# Altium project Longboard_32bit_ext.PrjPCB (part 6 of 6)
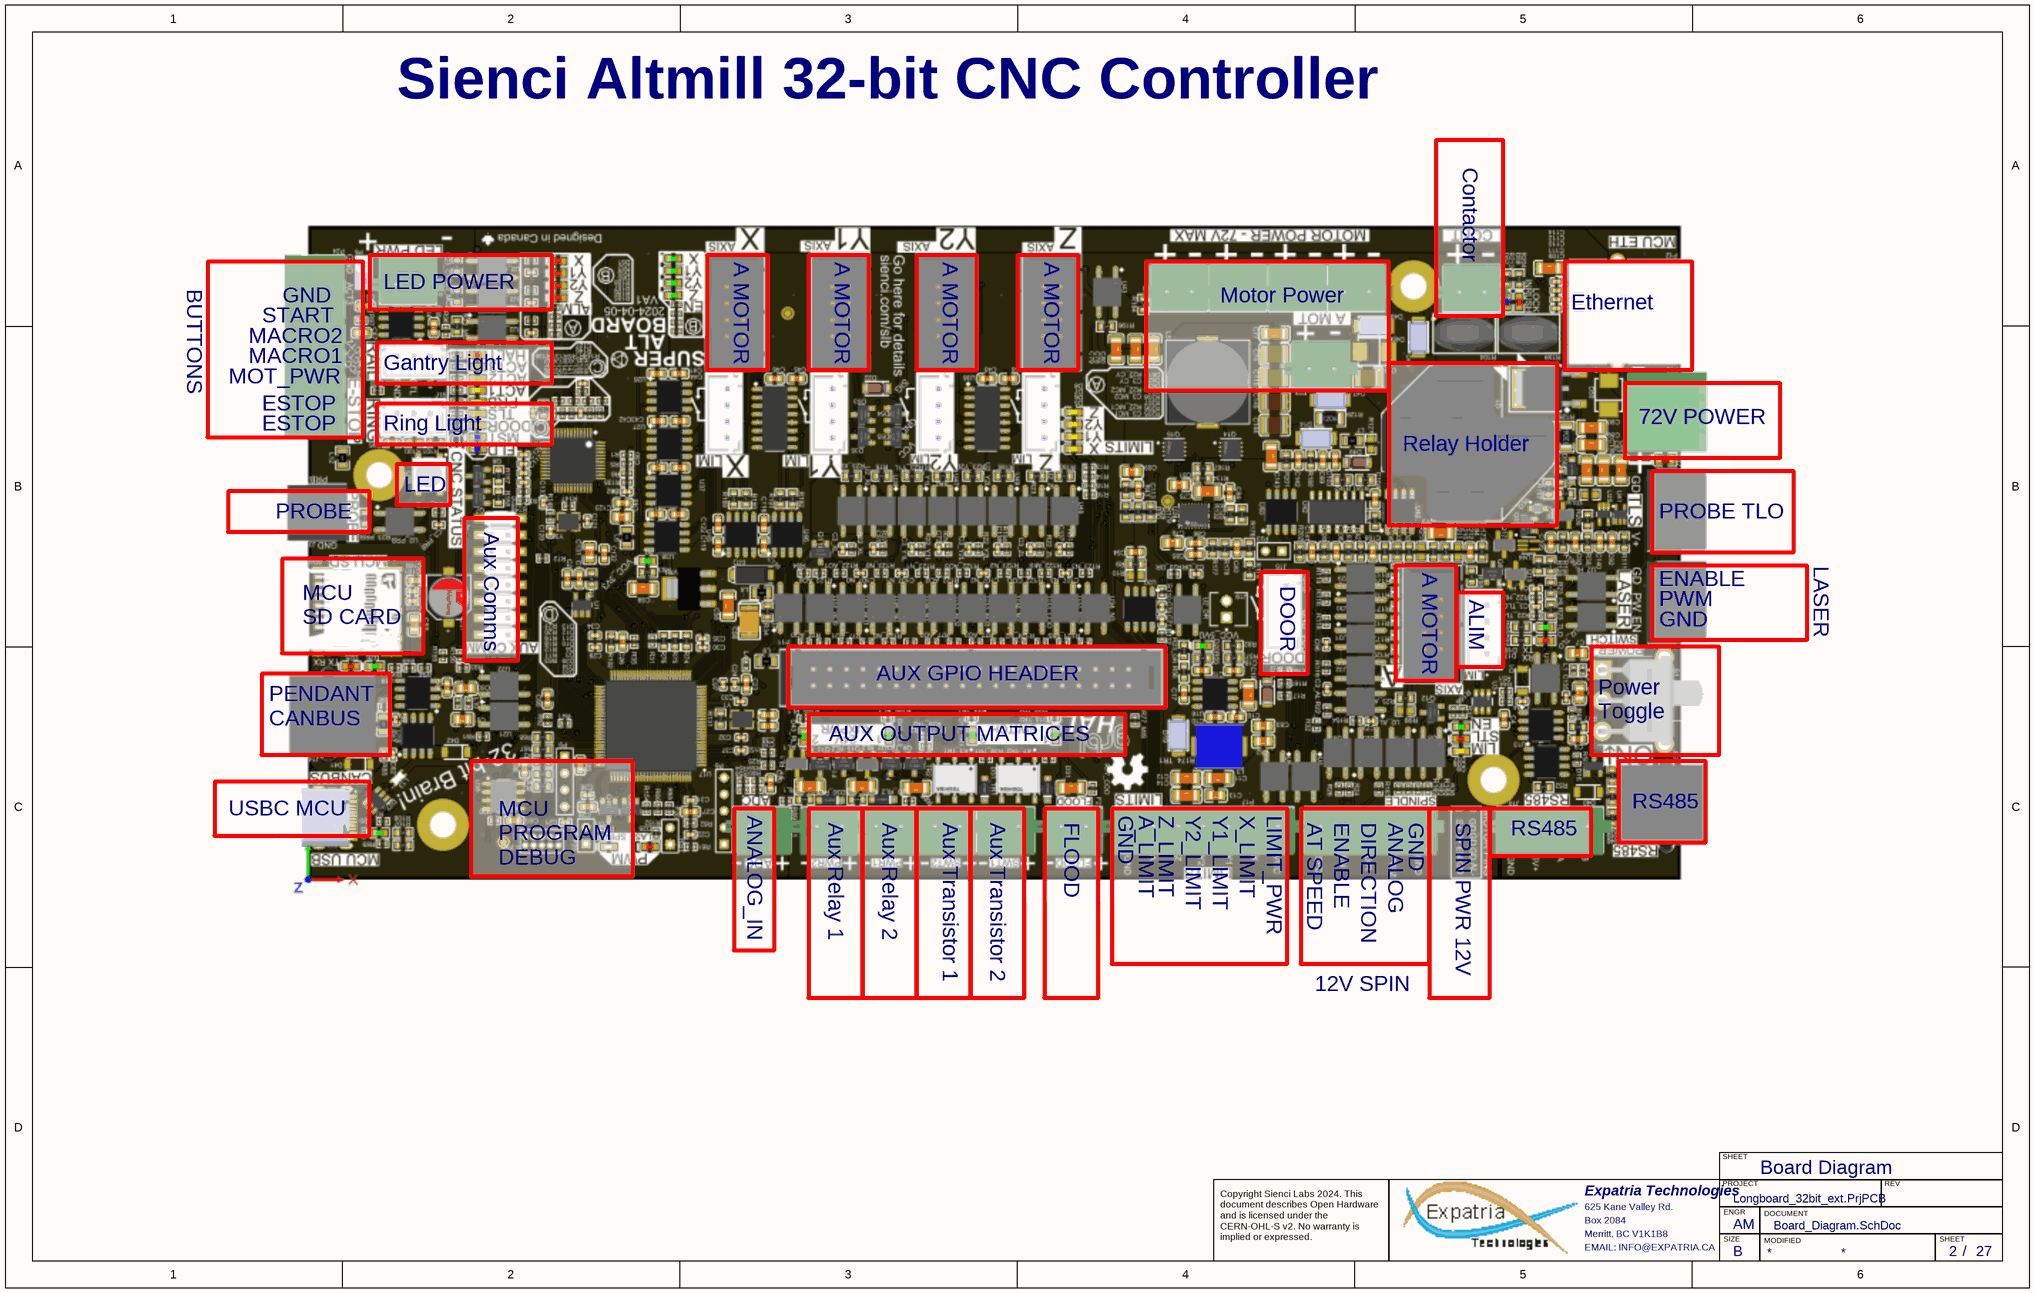
[diagram p28: Board_Diagram.SchDoc]

## Nets that join several sheets
GND: Limit_Switches (9 pins), Spindle_Control (10 pins), RS485 (C7.1 L2.1), DC_Power_Regulation (12 pins), 5V_Power_Supply (14 pins), 24V_Power_Supply (24 pins), DC_Power_Switching (37 pins), Stepper_driver_group (35 pins), Aux_Outputs (15 pins), Sienci CNC Controller/Additional IO/RL1 (Q2_RL1.2 Q10_RL1.2 R89_RL1.1), Sienci CNC Controller/Additional IO/RL2 (Q2_RL2.2 Q10_RL2.2 R89_RL2.1), Neopixel_Driver (8 pins), Sienci CNC Controller/Additional IO/TR1 (K1_TR1.2 Q9_TR1.2 R174_TR1.1), External_Stepper (7 pins), Sienci CNC Controller/Additional IO/AO0 (R77_AO0.1), Sienci CNC Controller/Additional IO/AO1 (R77_AO1.1), Sienci CNC Controller/Additional IO/AO2 (R77_AO2.1), Sienci CNC Controller/Additional IO/AO3 (R77_AO3.1), Sienci CNC Controller/Additional IO/COO (R77_COO.1), Sienci CNC Controller/Additional IO/MIS (R77_MIS.1), Sienci CNC Controller/Additional IO/N0 (U34_N0.2), Sienci CNC Controller/Additional IO/N1 (U34_N1.2), Sienci CNC Controller/Additional IO/N2 (U34_N2.2), Sienci CNC Controller/Additional IO/N3 (U34_N3.2), Sienci CNC Controller/Additional IO/TR2 (K1_TR2.2 Q9_TR2.2 R174_TR2.1)
INPUT_VCC: DC_Power_Regulation (C89.2 C90.2 L7.1 P10.1), DC_Power_Switching (8 pins)
LIMIT_VCC_SEL: Limit_Switches (10 pins), Sienci CNC Controller/Limit and Homing Inputs/TLO (R23_TLO.1), Sienci CNC Controller/Limit and Homing Inputs/PRB (R23_PRB.1), Sienci CNC Controller/Limit and Homing Inputs/XL (R23_XL.1), Sienci CNC Controller/Limit and Homing Inputs/Y1L (R23_Y1L.1), Sienci CNC Controller/Limit and Homing Inputs/Y2L (R23_Y2L.1), Sienci CNC Controller/Limit and Homing Inputs/ZL (R23_ZL.1), Sienci CNC Controller/Limit and Homing Inputs/AL (R23_AL.1), Sienci CNC Controller/Limit and Homing Inputs/DR (R23_DR.1)
MCU_GND: Longboard_32bit (C1.1 C2.1 U1.3), MCU_STM32F412VGT6 (48 pins), I2C_Keypad (P8.5 P9.4), Sienci CNC Controller/Limit and Homing Inputs/TLO (C3_TLO.1 U2_TLO.3), Sienci CNC Controller/Limit and Homing Inputs/PRB (C3_PRB.1 U2_PRB.3), Sienci CNC Controller/Limit and Homing Inputs/XL (C3_XL.1 U2_XL.3), Sienci CNC Controller/Limit and Homing Inputs/Y1L (C3_Y1L.1 U2_Y1L.3), Sienci CNC Controller/Limit and Homing Inputs/Y2L (C3_Y2L.1 U2_Y2L.3), Sienci CNC Controller/Limit and Homing Inputs/ZL (C3_ZL.1 U2_ZL.3), Sienci CNC Controller/Limit and Homing Inputs/AL (C3_AL.1 U2_AL.3), Sienci CNC Controller/Limit and Homing Inputs/DR (C3_DR.1 U2_DR.3), Sienci CNC Controller/User Inputs/CY (C3_CY.1 U2_CY.3), Sienci CNC Controller/User Inputs/MC1 (C3_MC1.1 U2_MC1.3), Sienci CNC Controller/User Inputs/HL (C3_HL.1 U2_HL.3), Sienci CNC Controller/User Inputs/MC2 (C3_MC2.1 U2_MC2.3), Spindle_Control (14 pins), RS485 (C134.2 D1.1 U12.4 U15.2), Ethernet_Interface (33 pins), DC_Power_Regulation (9 pins), Stepper_driver_group (20 pins), Aux_Outputs (9 pins), Neopixel_Driver (C68.2 U14.4), External_Stepper (6 pins), Sienci CNC Controller/Additional IO/AO0 (U33_AO0.2), Sienci CNC Controller/Additional IO/AO1 (U33_AO1.2), Sienci CNC Controller/Additional IO/AO2 (U33_AO2.2), Sienci CNC Controller/Additional IO/AO3 (U33_AO3.2), Sienci CNC Controller/Additional IO/COO (U33_COO.2), Sienci CNC Controller/Additional IO/MIS (U33_MIS.2), Sienci CNC Controller/Additional IO/N0 (C107_N0.1 U34_N0.3), Sienci CNC Controller/Additional IO/N1 (C107_N1.1 U34_N1.3), Sienci CNC Controller/Additional IO/N2 (C107_N2.1 U34_N2.3), Sienci CNC Controller/Additional IO/N3 (C107_N3.1 U34_N3.3), CANBUS_Pendant (9 pins), USB_Connector (9 pins)
MOTOR_VCC_80V: DC_Power_Regulation (R184.2), DC_Power_Switching (C91.2 D46.2 D48.2 K2.87), Stepper_driver_group (5 pins)
VCC_MCU_3V3: Longboard_32bit (C2.2 R8.2 U1.5), MCU_STM32F412VGT6 (32 pins), I2C_Keypad (P9.1), Limit_Switches (8 pins), Sienci CNC Controller/Limit and Homing Inputs/TLO (R22_TLO.2), Sienci CNC Controller/Limit and Homing Inputs/PRB (R22_PRB.2), Sienci CNC Controller/Limit and Homing Inputs/XL (R22_XL.2), Sienci CNC Controller/Limit and Homing Inputs/Y1L (R22_Y1L.2), Sienci CNC Controller/Limit and Homing Inputs/Y2L (R22_Y2L.2), Sienci CNC Controller/Limit and Homing Inputs/ZL (R22_ZL.2), Sienci CNC Controller/Limit and Homing Inputs/AL (R22_AL.2), Sienci CNC Controller/Limit and Homing Inputs/DR (R22_DR.2), Misc_switches (D10.A D11.A D12.A D13.A), Sienci CNC Controller/User Inputs/CY (R22_CY.2), Sienci CNC Controller/User Inputs/MC1 (R22_MC1.2), Sienci CNC Controller/User Inputs/HL (R22_HL.2), Sienci CNC Controller/User Inputs/MC2 (R22_MC2.2), Spindle_Control (R32.1 R35.1 R164.1), RS485 (D1.2 D17.A D18.A R44.2), Ethernet_Interface (8 pins), DC_Power_Regulation (C59.2 D24.A VR1.2), Stepper_driver_group (24 pins), Aux_Outputs (R110.1), Neopixel_Driver (R96.2), External_Stepper (D37.A D38.A R119.2), Sienci CNC Controller/Additional IO/N0 (R123_N0.1), Sienci CNC Controller/Additional IO/N1 (R123_N1.1), Sienci CNC Controller/Additional IO/N2 (R123_N2.1), Sienci CNC Controller/Additional IO/N3 (R123_N3.1), CANBUS_Pendant (6 pins)
VCC_MCU_5V0: I2C_Keypad (P8.1), Spindle_Control (R151.2 R152.2), DC_Power_Regulation (7 pins), Aux_Outputs (R155.2 R156.2), CANBUS_Pendant (C60.2 L10.1)
VCC_SYS_5V0: Limit_Switches (R9.1), Sienci CNC Controller/User Inputs/CY (R23_CY.1), Sienci CNC Controller/User Inputs/MC1 (R23_MC1.1), Sienci CNC Controller/User Inputs/HL (R23_HL.1), Sienci CNC Controller/User Inputs/MC2 (R23_MC2.1), Spindle_Control (6 pins), RS485 (C7.2 L1.1), DC_Power_Regulation (8 pins), 5V_Power_Supply (8 pins), DC_Power_Switching (18 pins), Stepper_driver_group (32 pins), Aux_Outputs (P11.7 P11.15 R112.1), Sienci CNC Controller/Additional IO/RL1 (R105_RL1.2), Sienci CNC Controller/Additional IO/RL2 (R105_RL2.2), Neopixel_Driver (C95.2 R97.2 R101.2 U28.1), Sienci CNC Controller/Additional IO/TR1 (R33_TR1.2), External_Stepper (R113.1 R115.1 R117.1 R120.2), Sienci CNC Controller/Additional IO/AO0 (R121_AO0.1), Sienci CNC Controller/Additional IO/AO1 (R121_AO1.1), Sienci CNC Controller/Additional IO/AO2 (R121_AO2.1), Sienci CNC Controller/Additional IO/AO3 (R121_AO3.1), Sienci CNC Controller/Additional IO/COO (R121_COO.1), Sienci CNC Controller/Additional IO/MIS (R121_MIS.1), Sienci CNC Controller/Additional IO/TR2 (R33_TR2.2)
VCC_SYS_24V0: Limit_Switches (R10.1), DC_Power_Regulation (R196.2), 5V_Power_Supply (C15.2 C16.2 U16.2), 24V_Power_Supply (7 pins), DC_Power_Switching (D45.2 K2.85 P6.2), Aux_Outputs (P11.18), Sienci CNC Controller/Additional IO/RL1 (D30_RL1.2 P18_RL1.2 R109_RL1.2), Sienci CNC Controller/Additional IO/RL2 (D30_RL2.2 P18_RL2.2 R109_RL2.2), Neopixel_Driver (P5.1 R100.2)
A_LIM: MCU_STM32F412VGT6 (U17.45), Limit_Switches (R17.2), Sienci CNC Controller/Limit and Homing Inputs/AL (C3_AL.2 R22_AL.1 U2_AL.4)
A_LIM_ext: Limit_Switches (J8.4 P17.2), Sienci CNC Controller/Limit and Homing Inputs/AL (U2_AL.2)
AL_A: Longboard_32bit (TP28.1), MCU_STM32F412VGT6 (U17.83), External_Stepper (C96.2 R119.1 R161.1 U32.4)
ANALOG_IN: Longboard_32bit (TP60.1), MCU_STM32F412VGT6 (U17.23), Aux_Outputs (R59.1)
AUX_IN0_5V: Aux_Outputs (P11.22), Sienci CNC Controller/Additional IO/N0 (R124_N0.1)
AUX_IN1_5V: Aux_Outputs (P11.26), Sienci CNC Controller/Additional IO/N1 (R124_N1.1)
AUX_IN2_5V: Aux_Outputs (P11.30), Sienci CNC Controller/Additional IO/N2 (R124_N2.1)
AUX_IN3_5V: Aux_Outputs (P11.34), Sienci CNC Controller/Additional IO/N3 (R124_N3.1)
AUX_IN_0: Longboard_32bit (TP53.1), MCU_STM32F412VGT6 (U17.59), Sienci CNC Controller/Additional IO/N0 (C107_N0.2 R123_N0.2 U34_N0.4)
AUX_IN_1: Longboard_32bit (TP54.1), MCU_STM32F412VGT6 (U17.60), Sienci CNC Controller/Additional IO/N1 (C107_N1.2 R123_N1.2 U34_N1.4)
AUX_IN_2: Longboard_32bit (TP55.1), MCU_STM32F412VGT6 (U17.61), Sienci CNC Controller/Additional IO/N2 (C107_N2.2 R123_N2.2 U34_N2.4)
AUX_IN_3: Longboard_32bit (TP56.1), MCU_STM32F412VGT6 (U17.62), Sienci CNC Controller/Additional IO/N3 (C107_N3.2 R123_N3.2 U34_N3.4)
AUX_OUT_0_5V: Aux_Outputs (P11.19), Sienci CNC Controller/Additional IO/RL1 (Q2_RL1.1 Q10_RL1.1 R89_RL1.2), Sienci CNC Controller/Additional IO/AO0 (R77_AO0.2 U33_AO0.3)
AUX_OUT_1_5V: Aux_Outputs (P11.21), Sienci CNC Controller/Additional IO/RL2 (Q2_RL2.1 Q10_RL2.1 R89_RL2.2), Sienci CNC Controller/Additional IO/AO1 (R77_AO1.2 U33_AO1.3)
AUX_OUT_2_5V: Aux_Outputs (P11.25), Sienci CNC Controller/Additional IO/TR1 (Q9_TR1.1 R39_TR1.1 R174_TR1.2), Sienci CNC Controller/Additional IO/AO2 (R77_AO2.2 U33_AO2.3)
AUX_OUT_3_5V: Aux_Outputs (P11.27), Sienci CNC Controller/Additional IO/AO3 (R77_AO3.2 U33_AO3.3), Sienci CNC Controller/Additional IO/TR2 (Q9_TR2.1 R39_TR2.1 R174_TR2.2)
AUXOUT_0: Longboard_32bit (TP1.1), MCU_STM32F412VGT6 (U17.8), Sienci CNC Controller/Additional IO/AO0 (R122_AO0.1)
AUXOUT_1: Longboard_32bit (TP2.1), MCU_STM32F412VGT6 (U17.15), Sienci CNC Controller/Additional IO/AO1 (R122_AO1.1)
AUXOUT_2: Longboard_32bit (TP33.1), MCU_STM32F412VGT6 (U17.16), Sienci CNC Controller/Additional IO/AO2 (R122_AO2.1)
AUXOUT_3: Longboard_32bit (TP34.1), MCU_STM32F412VGT6 (U17.65), Sienci CNC Controller/Additional IO/AO3 (R122_AO3.1)
CAN_RX: Longboard_32bit (TP32.1), MCU_STM32F412VGT6 (U17.81), CANBUS_Pendant (R94.1 U18.2)
CAN_TX: Longboard_32bit (TP31.1), MCU_STM32F412VGT6 (U17.82), CANBUS_Pendant (R95.1 U18.3)
COOLANT: MCU_STM32F412VGT6 (U17.53), Aux_Outputs (Q6.1 R157.2), Sienci CNC Controller/Additional IO/COO (R122_COO.1)
COOLANT_5V: Aux_Outputs (J17.2 P11.31), Sienci CNC Controller/Additional IO/COO (R77_COO.2 U33_COO.3)
CYC/ST: MCU_STM32F412VGT6 (U17.79), Misc_switches (R20.2), Sienci CNC Controller/User Inputs/CY (C3_CY.2 R22_CY.1 U2_CY.4)
DIR: MCU_STM32F412VGT6 (U17.35), RS485 (R51.2)
DIR_A: Longboard_32bit (TP52.1), MCU_STM32F412VGT6 (U17.42), External_Stepper (R116.1)
DIR_A_EXT: Aux_Outputs (P11.6), External_Stepper (P20.3 R171.1 U30.3)
DIR_X: Longboard_32bit (TP48.1), MCU_STM32F412VGT6 (U17.38), Stepper_driver_group (U26.3)
DIR_Y1: Longboard_32bit (TP49.1), MCU_STM32F412VGT6 (U17.39), Stepper_driver_group (U27.3)
DIR_Y2: Longboard_32bit (TP51.1), MCU_STM32F412VGT6 (U17.41), Stepper_driver_group (U37.3)
DIR_Z: Longboard_32bit (TP50.1), MCU_STM32F412VGT6 (U17.40), Stepper_driver_group (U38.3)
DOOR: Longboard_32bit (TP58.1), MCU_STM32F412VGT6 (U17.88), Limit_Switches (R63.2), Sienci CNC Controller/Limit and Homing Inputs/DR (C3_DR.2 R22_DR.1 U2_DR.4)
DOOR_IN_5V: Limit_Switches (J15.4), Sienci CNC Controller/Limit and Homing Inputs/DR (U2_DR.2), Aux_Outputs (P11.13)
EN_A_EXT: Aux_Outputs (P11.8), External_Stepper (P20.5 R172.1 U31.3)
ENN_X: Longboard_32bit (TP35.1), MCU_STM32F412VGT6 (U17.85), Stepper_driver_group (R185.1 U45.2)
ENN_Y1: Longboard_32bit (TP39.1 TP41.1), MCU_STM32F412VGT6 (U17.64), Stepper_driver_group (R186.1 R187.1 U45.3 U46.2)
ENN_Z: Longboard_32bit (TP40.1), MCU_STM32F412VGT6 (U17.84), Stepper_driver_group (R188.1 U46.3)
ESTOP_5V_EN: DC_Power_Regulation (P23.1 P24.6), DC_Power_Switching (6 pins)
HALT: Longboard_32bit (TP20.1 U1.2), Misc_switches (R21.2), Sienci CNC Controller/User Inputs/HL (C3_HL.2 R22_HL.1 U2_HL.4)
HALT_ext: Sienci CNC Controller/User Inputs/HL (U2_HL.2), DC_Power_Regulation (D32.K Q3.3 R38.1)
HALT_n: Longboard_32bit (C1.2 R8.1 TP19.1 U1.4), MCU_STM32F412VGT6 (U17.51), I2C_Keypad (P8.3)
HALT_PENDANT: Longboard_32bit (TP18.1 U1.1), CANBUS_Pendant (C65.2 R90.1 U21.4)
KPSTR: MCU_STM32F412VGT6 (R64.1 U17.89), I2C_Keypad (P8.4), CANBUS_Pendant (C66.2 R92.1 U22.4)
LASER_EN: Longboard_32bit (TP57.1), MCU_STM32F412VGT6 (U17.80), Spindle_Control (Q12.1 R37.1 R166.2)
Laser_PWM: Longboard_32bit (TP59.1), MCU_STM32F412VGT6 (U17.63), Spindle_Control (Q5.1 R41.1 R154.2)
LED Control: Longboard_32bit (TP36.1), MCU_STM32F412VGT6 (U17.66), Neopixel_Driver (U14.2)
MAC1: Longboard_32bit (TP16.1), MCU_STM32F412VGT6 (U17.98), Misc_switches (R18.2), Sienci CNC Controller/User Inputs/MC1 (C3_MC1.2 R22_MC1.1 U2_MC1.4)
MAC2: Longboard_32bit (TP17.1), MCU_STM32F412VGT6 (U17.97), Misc_switches (R19.2), Sienci CNC Controller/User Inputs/MC2 (C3_MC2.2 R22_MC2.1 U2_MC2.4)
Macro1_ext: Sienci CNC Controller/User Inputs/MC1 (U2_MC1.2), DC_Power_Regulation (P24.4)
Macro2_ext: Sienci CNC Controller/User Inputs/MC2 (U2_MC2.2), DC_Power_Regulation (P24.3)
MIST: MCU_STM32F412VGT6 (U17.90), Aux_Outputs (Q7.1 R158.2), Sienci CNC Controller/Additional IO/MIS (R122_MIS.1)
MIST_5V: Aux_Outputs (P11.33), Sienci CNC Controller/Additional IO/MIS (R77_MIS.2 U33_MIS.3)
MOTOR_nPGD: DC_Power_Regulation (Q3.1), DC_Power_Switching (U44.4)
PRB_TLO: MCU_STM32F412VGT6 (U17.9), Limit_Switches (R11.2), Sienci CNC Controller/Limit and Homing Inputs/TLO (C3_TLO.2 R22_TLO.1 U2_TLO.4)
PRB_TLO_ext: Limit_Switches (J2.2), Sienci CNC Controller/Limit and Homing Inputs/TLO (U2_TLO.2)
PROBE: MCU_STM32F412VGT6 (U17.33), Limit_Switches (R12.2), Sienci CNC Controller/Limit and Homing Inputs/PRB (C3_PRB.2 R22_PRB.1 U2_PRB.4)
PROBE_ext: Limit_Switches (J3.2), Sienci CNC Controller/Limit and Homing Inputs/PRB (U2_PRB.2)
PRU_RESET: Longboard_32bit (TP21.1), MCU_STM32F412VGT6 (U17.57), Ethernet_Interface (J1.14)
PWR_EN: DC_Power_Regulation (C113.2 S1.2), 24V_Power_Supply (R30.1 R43.2 U24.1)
PWR_IN_36-80V: DC_Power_Regulation (D14.2), 24V_Power_Supply (11 pins)
RXD: MCU_STM32F412VGT6 (U17.87), RS485 (R53.1 U12.2)
RXD_AUX: Longboard_32bit (TP9.1), MCU_STM32F412VGT6 (U17.34), Aux_Outputs (U20.2)
RXD_INT: Longboard_32bit (TP15.1), MCU_STM32F412VGT6 (R72.1 U17.69), Ethernet_Interface (J1.2 U11.36)
SBC_SPI_CLK: Longboard_32bit (TP4.1), MCU_STM32F412VGT6 (R74.2 SD3.5), Ethernet_Interface (J1.13 U11.33)
SBC_SPI_PICO: Longboard_32bit (TP5.1), MCU_STM32F412VGT6 (R76.2 SD3.3), Ethernet_Interface (J1.5 U11.35)
SBC_SPI_POCI: Longboard_32bit (TP6.1), MCU_STM32F412VGT6 (R75.2 SD3.7), Ethernet_Interface (J1.9 U11.34)
SCL: Longboard_32bit (TP11.1), MCU_STM32F412VGT6 (R66.1 U17.92 U35.6), I2C_Keypad (P9.2)
SDA: Longboard_32bit (TP13.1), MCU_STM32F412VGT6 (R65.1 U17.93 U35.5), I2C_Keypad (P9.3)
SG_X: Longboard_32bit (TP22.1), MCU_STM32F412VGT6 (U17.77), Stepper_driver_group (C51.2 R27.1 R205.1 U39.4)
SG_Y1: Longboard_32bit (TP23.1), MCU_STM32F412VGT6 (U17.24), Stepper_driver_group (C72.2 R79.1 R206.1 U47.4)
SG_Y2: Longboard_32bit (TP26.1), MCU_STM32F412VGT6 (U17.26), Stepper_driver_group (C138.2 R194.1 R207.1 U49.4)
SG_Z: Longboard_32bit (TP24.1), MCU_STM32F412VGT6 (U17.25), Stepper_driver_group (C137.2 R81.1 R208.1 U48.4)
SPI_CS_JOG_SW: Longboard_32bit (TP3.1), MCU_STM32F412VGT6 (U17.29), Ethernet_Interface (J1.1 U11.32)
SPINDLE_AT_SPEED: MCU_STM32F412VGT6 (U17.95), Spindle_Control (C73.2 R164.2 U23.4)
SPINDLE_DIR: MCU_STM32F412VGT6 (U17.36), Spindle_Control (R31.1)
SPINDLE_EN: MCU_STM32F412VGT6 (U17.44), Spindle_Control (Q11.1 R84.2)
SPINDLE_EN_5V: Spindle_Control (U7.3), Aux_Outputs (P11.37)
SPINDLE_PWM: MCU_STM32F412VGT6 (U17.67), Spindle_Control (Q4.1 R25.1 R153.2)
Start_ext: Sienci CNC Controller/User Inputs/CY (U2_CY.2), DC_Power_Regulation (P24.2)
STEP_A: Longboard_32bit (TP47.1), MCU_STM32F412VGT6 (U17.47), External_Stepper (R114.1)
STEP_A_EXT: Aux_Outputs (P11.2), External_Stepper (P20.1 R170.1 U29.3)
STEP_EN_A: Longboard_32bit (TP42.1), MCU_STM32F412VGT6 (U17.78), External_Stepper (R98.2 R118.1)
STEP_X: Longboard_32bit (TP43.1), MCU_STM32F412VGT6 (U17.1), Stepper_driver_group (U26.2)
STEP_Y1: Longboard_32bit (TP44.1), MCU_STM32F412VGT6 (U17.2), Stepper_driver_group (U27.2)
STEP_Y2: Longboard_32bit (TP46.1), MCU_STM32F412VGT6 (U17.4), Stepper_driver_group (U37.2)
STEP_Z: Longboard_32bit (TP45.1), MCU_STM32F412VGT6 (U17.3), Stepper_driver_group (U38.2)
STM_BOOT0: MCU_STM32F412VGT6 (C21.2 P25.2 R61.1 U17.94), Ethernet_Interface (R2.1)
STM_RESET: MCU_STM32F412VGT6 (5 pins), Ethernet_Interface (J1.10)
STP_ALARM_5V_n: Aux_Outputs (P11.10), External_Stepper (P20.8 U32.2)
SWCLK: Longboard_32bit (TP38.1), MCU_STM32F412VGT6 (P15.4 U17.76), Ethernet_Interface (R4.1)
SWDIO: Longboard_32bit (TP37.1 TP61.1), MCU_STM32F412VGT6 (P15.2 U17.72), Ethernet_Interface (R3.1), Neopixel_Driver (U14.3)
TXD: MCU_STM32F412VGT6 (U17.86), RS485 (R54.1 U12.3)
TXD_AUX: Longboard_32bit (TP7.1), MCU_STM32F412VGT6 (U17.55), Aux_Outputs (U20.3)
TXD_INT: Longboard_32bit (TP14.1), MCU_STM32F412VGT6 (U17.68), Ethernet_Interface (C82.2 J1.4 R135.2 U11.37)
USB_D_N: MCU_STM32F412VGT6 (R68.2), USB_Connector (L13.3)
USB_D_P: MCU_STM32F412VGT6 (R67.2), USB_Connector (L13.2)
X_LIM: MCU_STM32F412VGT6 (U17.91), Limit_Switches (R13.2), Sienci CNC Controller/Limit and Homing Inputs/XL (C3_XL.2 R22_XL.1 U2_XL.4)
X_LIM_ext: Limit_Switches (J4.4 P17.6), Sienci CNC Controller/Limit and Homing Inputs/XL (U2_XL.2)
Y2_LIM: MCU_STM32F412VGT6 (U17.5), Limit_Switches (R15.2), Sienci CNC Controller/Limit and Homing Inputs/Y2L (C3_Y2L.2 R22_Y2L.1 U2_Y2L.4)
Y2_LIM_ext: Limit_Switches (J6.4 P17.4), Sienci CNC Controller/Limit and Homing Inputs/Y2L (U2_Y2L.2)
Y_LIM: MCU_STM32F412VGT6 (U17.96), Limit_Switches (R14.2), Sienci CNC Controller/Limit and Homing Inputs/Y1L (C3_Y1L.2 R22_Y1L.1 U2_Y1L.4)
Y_LIM_ext: Limit_Switches (J5.4 P17.5), Sienci CNC Controller/Limit and Homing Inputs/Y1L (U2_Y1L.2)
Z_LIM: MCU_STM32F412VGT6 (U17.7), Limit_Switches (R16.2), Sienci CNC Controller/Limit and Homing Inputs/ZL (C3_ZL.2 R22_ZL.1 U2_ZL.4)
Z_LIM_ext: Limit_Switches (J7.4 P17.3), Sienci CNC Controller/Limit and Homing Inputs/ZL (U2_ZL.2)

## Assembly variants
FULL_PLACE: not fitted J19 J35 J36 P7 P8 P9 P15 P22 R10 R99 R100 R127 R182 R212 R215